# Altium schematic sheet SHDN-BSPD-S02-V00-BSPDSystem.SchDoc: BSPD System
size A3; DrawnBy: Jonn Dillon; DocumentNumber: 2; Revision: 01; SheetNumber: 2; SheetTotal: 10
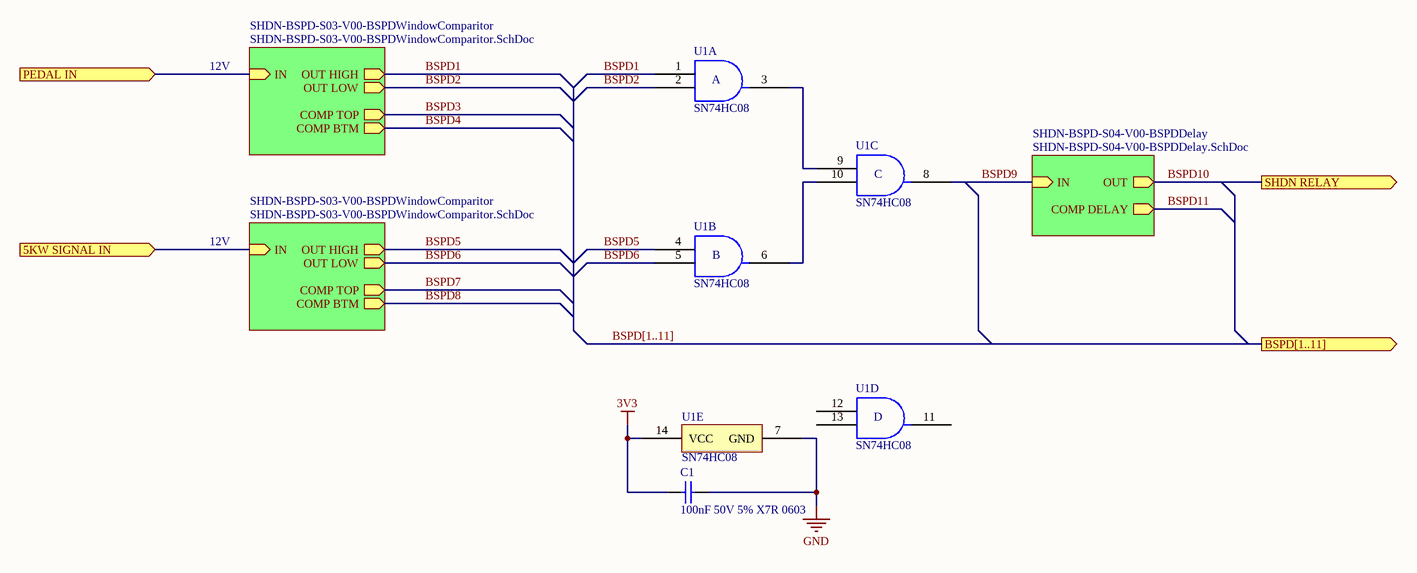
[diagram p0: SHDN-BSPD-S02-V00-BSPDSystem.SchDoc]

## Parts
C1  100nF 50V 5% X7R 0603  [Cap_Ceramic_0603]
U1  SN74HC08  [TSSOP-14]  (parts A,B,C,D,E of 5)

## Sub-sheets
SHDN-BSPD-S03-V00-BSPDWindowComparitor = SHDN-BSPD-S03-V00-BSPDWindowComparitor.SchDoc: COMP TOP (out), IN (in), COMP BTM (out), OUT HIGH (out), OUT LOW (out)
SHDN-BSPD-S03-V00-BSPDWindowComparitor = SHDN-BSPD-S03-V00-BSPDWindowComparitor.SchDoc: COMP TOP (out), IN (in), COMP BTM (out), OUT HIGH (out), OUT LOW (out)
SHDN-BSPD-S04-V00-BSPDDelay = SHDN-BSPD-S04-V00-BSPDDelay.SchDoc: IN (in), OUT (out), COMP DELAY (out)

## Ports
5KW SIGNAL IN (in), BSPD[1..11] (out), PEDAL IN (in), SHDN RELAY (out)

## Nets
3V3: C1.2 U1.14(VCC)
GND: C1.1 U1.7(GND)
5KW SIGNAL IN: port 5KW SIGNAL IN, sheet SHDN-BSPD-S03-V00-BSPDWindowComparitor/IN
BSPD1: U1.1(1A) ; sheet SHDN-BSPD-S03-V00-BSPDWindowComparitor/OUT HIGH
BSPD2: U1.2(1B) ; sheet SHDN-BSPD-S03-V00-BSPDWindowComparitor/OUT LOW
BSPD3: sheet SHDN-BSPD-S03-V00-BSPDWindowComparitor/COMP TOP
BSPD4: sheet SHDN-BSPD-S03-V00-BSPDWindowComparitor/COMP BTM
BSPD5: U1.4(2A) ; sheet SHDN-BSPD-S03-V00-BSPDWindowComparitor/OUT HIGH
BSPD6: U1.5(2B) ; sheet SHDN-BSPD-S03-V00-BSPDWindowComparitor/OUT LOW
BSPD7: sheet SHDN-BSPD-S03-V00-BSPDWindowComparitor/COMP TOP
BSPD8: sheet SHDN-BSPD-S03-V00-BSPDWindowComparitor/COMP BTM
BSPD9: U1.8(3Y) ; sheet SHDN-BSPD-S04-V00-BSPDDelay/IN
BSPD10: port SHDN RELAY, sheet SHDN-BSPD-S04-V00-BSPDDelay/OUT
BSPD11: sheet SHDN-BSPD-S04-V00-BSPDDelay/COMP DELAY
PEDAL IN: port PEDAL IN, sheet SHDN-BSPD-S03-V00-BSPDWindowComparitor/IN
NetU1_3: U1.3(1Y) U1.9(3A)
NetU1_6: U1.6(2Y) U1.10(3B)

Not connected (* = marked no-connect by the designer): U1 11(4Y) 12(4A) 13(4B)

## Buses and harness runs
bus BSPD[1..11] = port BSPD[1..11]

## Notes on the sheet
- 12V
- Revision History:
- Sheet Title:
- Rev
- Date
- Description
- Project:
- Size:
- Drawn By:
- A3
- Number:
- Revision:
- Sheet
- Version:
- of
- QUT Motorsport
- O-120, Gardens Point
- 2 George Street
- Brisbane, QLD 4000
- Australia
- Print Date:
- Print Time:
- File Name:
- (in symbol SN74HC08, part A) A
- (in symbol SN74HC08, part B) B
- (in symbol SN74HC08, part C) C
- (in symbol SN74HC08, part D) D

## Library data of the parts
C1 = 100nF 50V 5% X7R 0603: Capacitor, Ceramic, SMD, 100nF, 50V, 5%, X7R, 0603
U1 = SN74HC08: Quadruple 2-Input Positive-AND Gates